# Altium schematic sheet CO2_Sensor.SchDoc: Lab. Proj. PCB
size A4; Author: Tomasz Machnik; Revision: 1; SheetNumber: 2; SheetTotal: 7
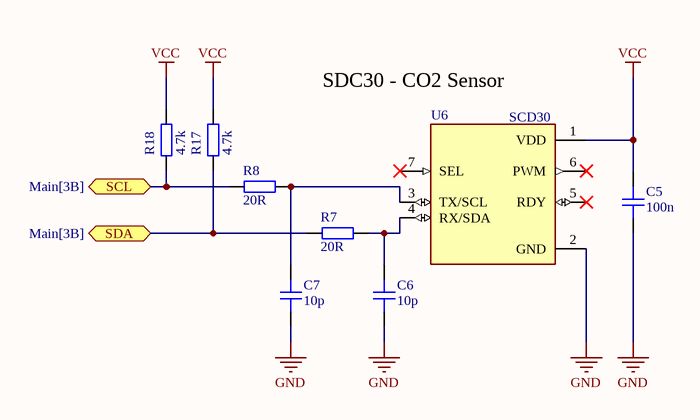
[diagram p0: CO2_Sensor.SchDoc]

## Parts
C5  100n  [CAP_0805]
C6  10p  [CAP_0805]
C7  10p  [CAP_0805]
R7  20R  [RES_0805]
R8  20R  [RES_0805]
R17  4.7k  [RES_0805]
R18  4.7k  [RES_0805]
U6  SCD30  [SDC30]

## Ports
SCL (bidir, see Main[3B]), SDA (bidir, see Main[3B])

## Nets
GND: C5.1 C6.1 C7.1 U6.2(GND)
VCC: C5.2 R17.1 R18.1 U6.1(VDD)
SCL: R8.2 R18.2 ; port SCL
SDA: R7.2 R17.2 ; port SDA
NetC6_2: C6.2 R7.1 U6.4(RX/SDA)
NetC7_2: C7.2 R8.1 U6.3(TX/SCL)

Not connected (* = marked no-connect by the designer): U6 5(RDY)* 6(PWM)* 7(SEL)*

## Notes on the sheet
- (near U6) SDC30 - CO2 Sensor
- Title:
- Author:
- Approved:
- Size:
- Date:
- Git Hash:
- A4
- Prj:
- SW Version:
- Variant:
- Edited:
- CONFIDENTIAL
- File:

## Library data of the parts
C5-C7 = CAP_0805: Capacitor SMD 0805; Manufacturer: *; Manufacturer Part Number: *; Distributor Link: *; LCSC: *; Rating: *; Dielectric: *
R7 R8 R17 R18 = RES_0805: Resistor SMD 0805; Manufacturer: *; Manufacturer Part Number: *; Distributor Link: *; LCSC: *
U6 = SCD30: SCD30 Series 5.5 V 75 mA Â±3% Carbon Dioxide (CO2) Sensor Module; Package: None; Availability: Unavailable; MP: SCD30; Value: *; Price: None